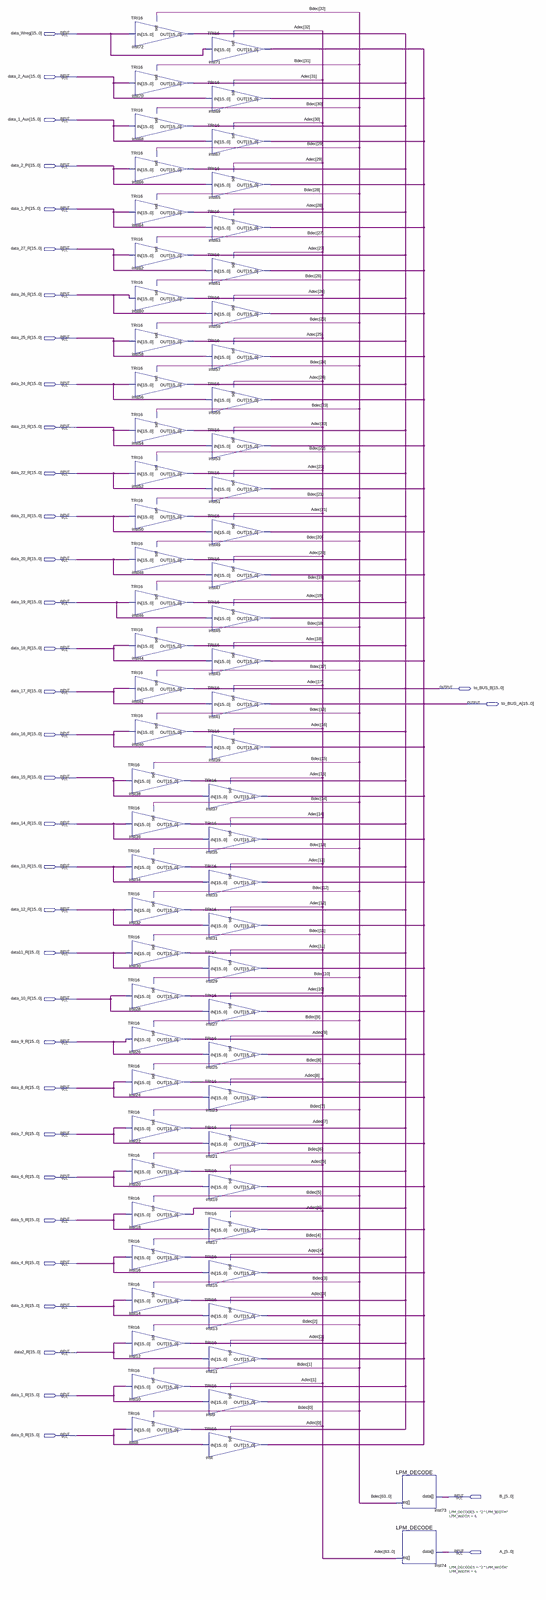
[diagram p0: schematic sheet, whole]
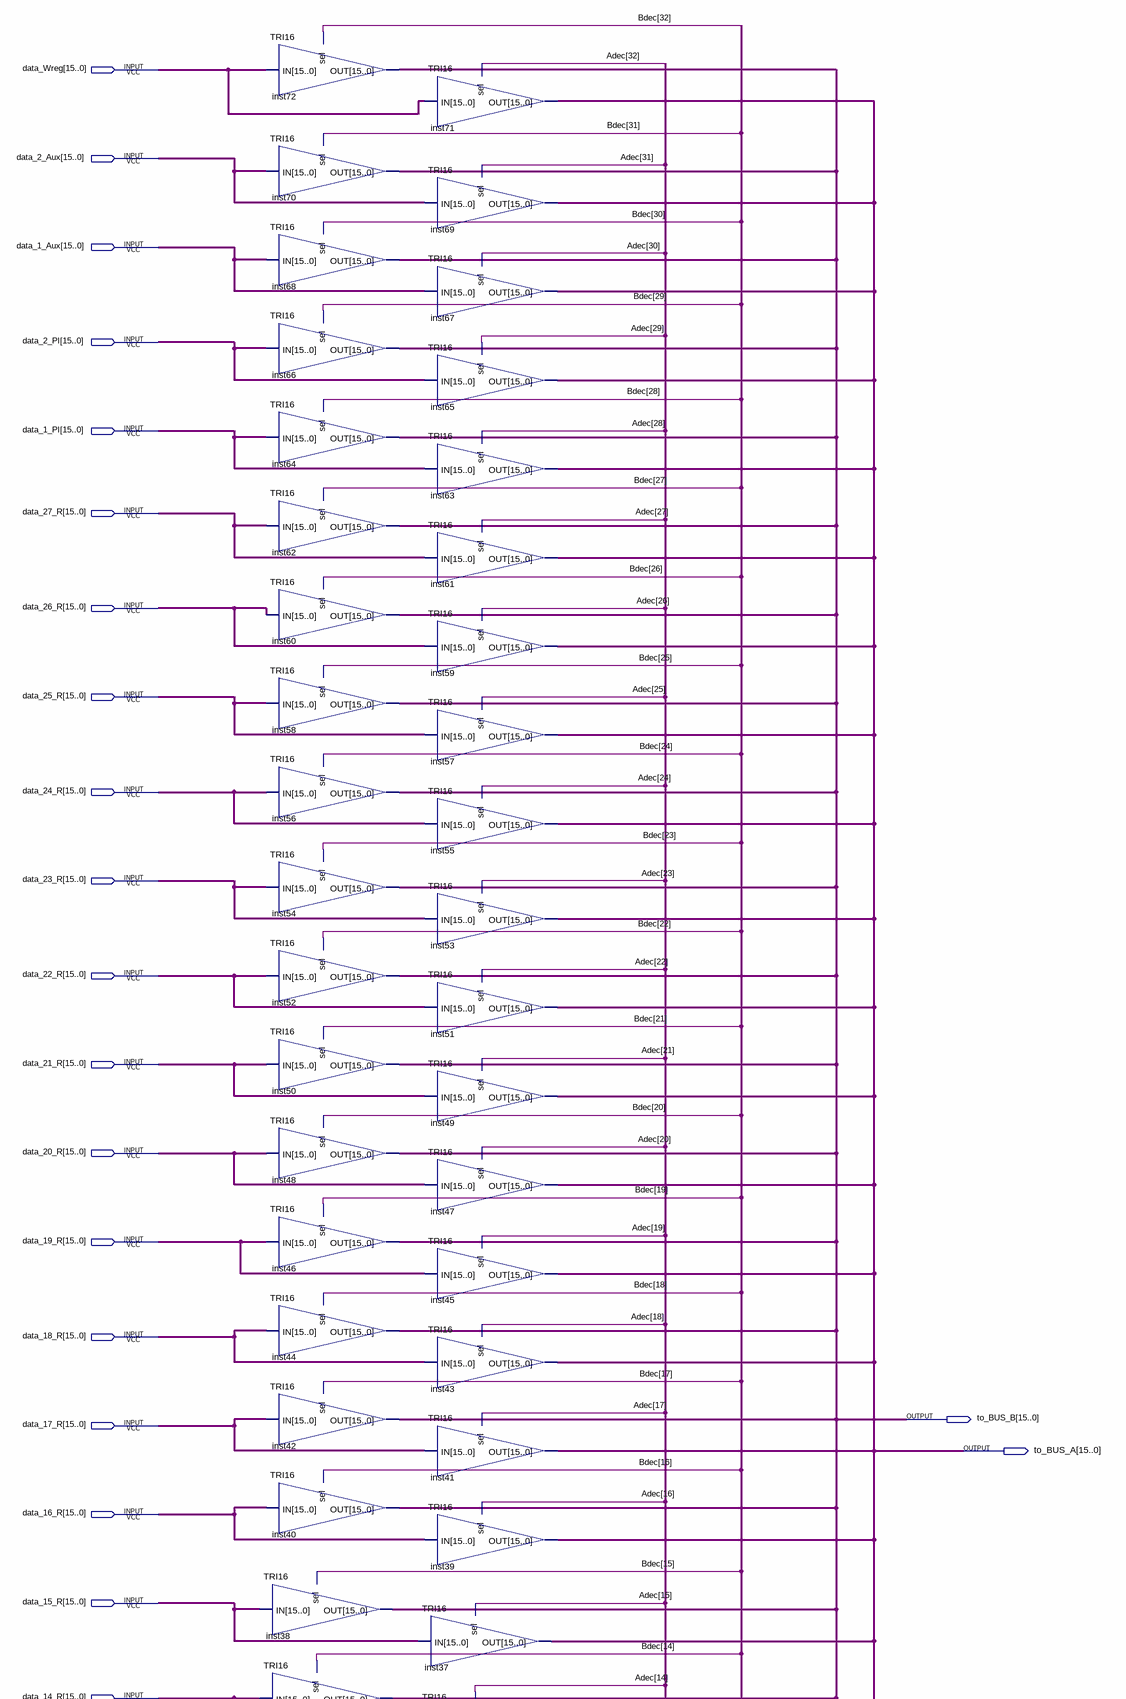
[diagram p1: schematic sheet, upper part]
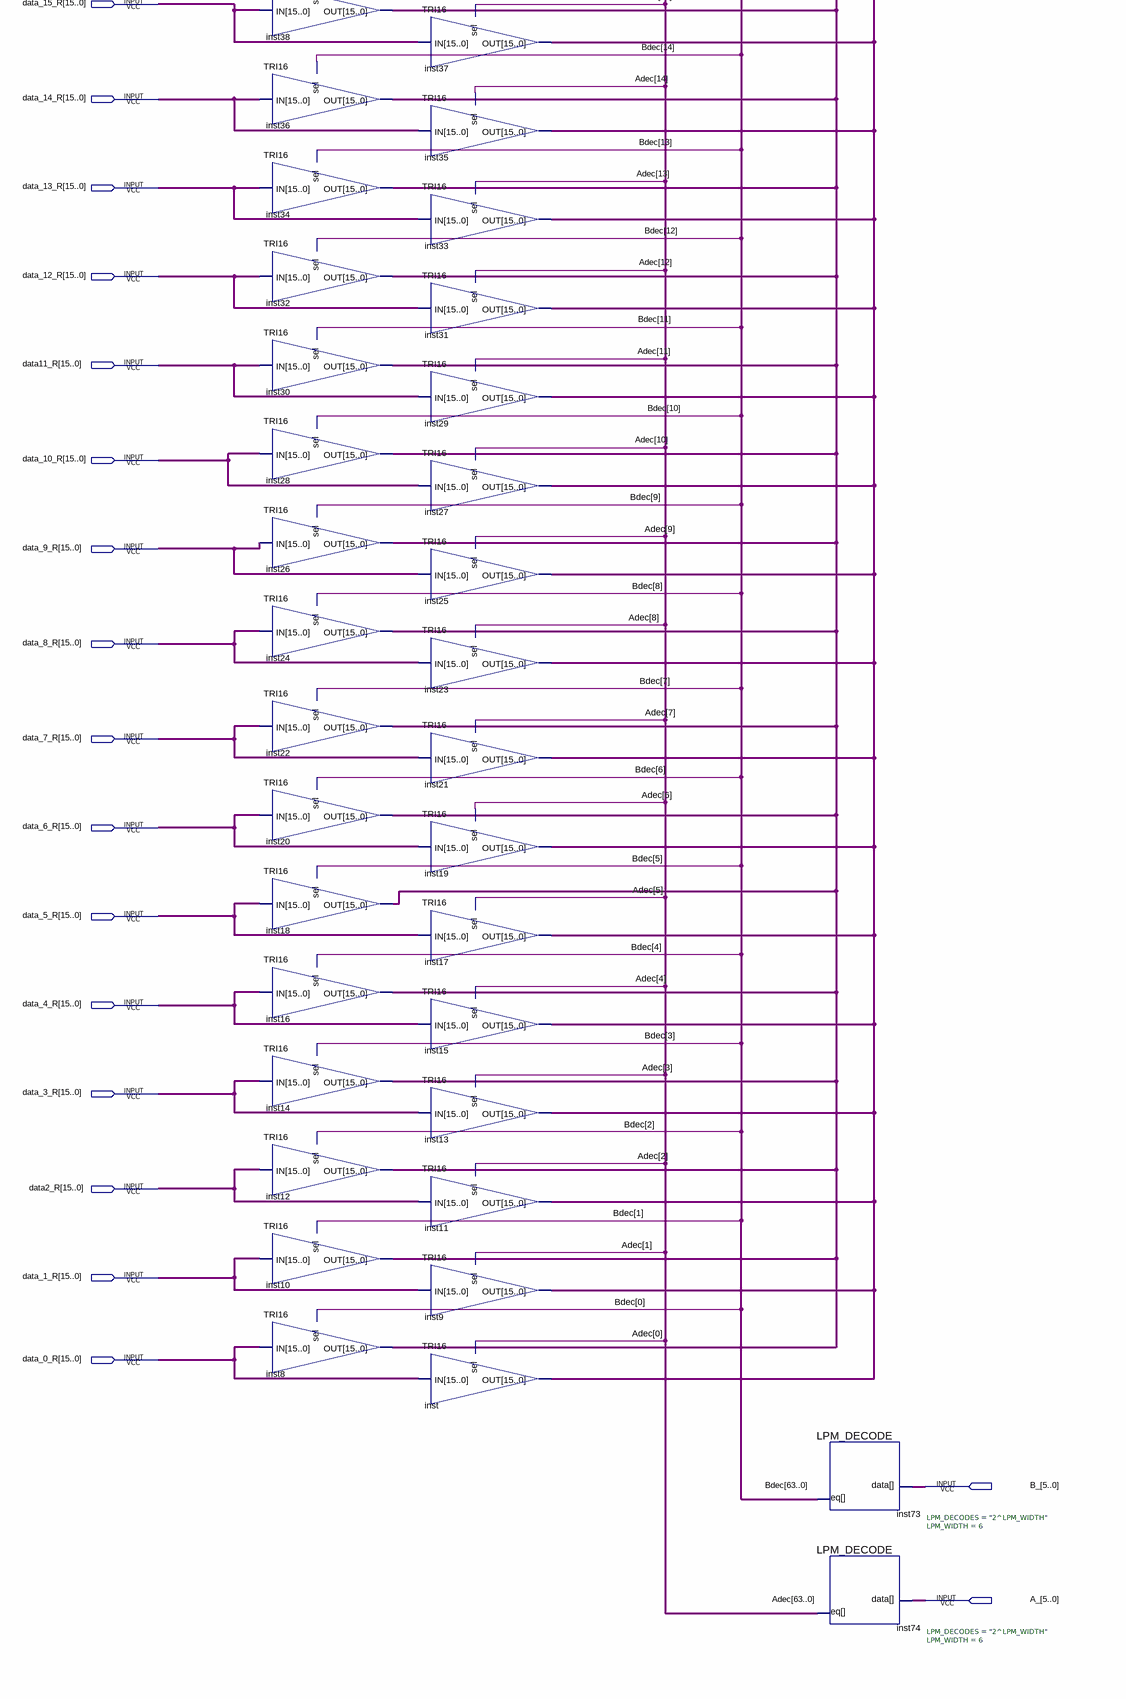
[diagram p2: schematic sheet, lower part]
// Quartus schematic block3.bdf as structural Verilog: 68 symbols, 37 pins
module block3 (
  input  [15:0] data_Wreg,
  input  [15:0] data_2_Aux,
  input  [15:0] data_1_Aux,
  input  [15:0] data_2_PI,
  input  [15:0] data_1_PI,
  input  [15:0] data_27_R,
  input  [15:0] data_26_R,
  input  [15:0] data_25_R,
  input  [15:0] data_24_R,
  input  [15:0] data_23_R,
  input  [15:0] data_22_R,
  input  [15:0] data_21_R,
  input  [15:0] data_20_R,
  input  [15:0] data_19_R,
  input  [15:0] data_18_R,
  input  [15:0] data_17_R,
  input  [15:0] data_16_R,
  input  [15:0] data_15_R,
  input  [15:0] data_14_R,
  input  [15:0] data_13_R,
  input  [15:0] data_12_R,
  input  [15:0] data11_R,
  input  [15:0] data_10_R,
  input  [15:0] data_9_R,
  input  [15:0] data_8_R,
  input  [15:0] data_7_R,
  input  [15:0] data_6_R,
  input  [15:0] data_5_R,
  input  [15:0] data_4_R,
  input  [15:0] data_3_R,
  input  [15:0] data2_R,
  input  [15:0] data_1_R,
  input  [15:0] data_0_R,
  input  [5:0] B_,
  input  [5:0] A_,
  output [15:0] to_BUS_B,
  output [15:0] to_BUS_A
);

  wire [63:0] Adec, Bdec;

  TRI16 inst72 (.sel(Bdec[32]), .IN(data_Wreg), .OUT(to_BUS_B));
  TRI16 inst70 (.sel(Bdec[31]), .IN(data_2_Aux), .OUT(to_BUS_B));
  TRI16 inst68 (.sel(Bdec[30]), .IN(data_1_Aux), .OUT(to_BUS_B));
  TRI16 inst66 (.sel(Bdec[29]), .IN(data_2_PI), .OUT(to_BUS_B));
  TRI16 inst64 (.sel(Bdec[28]), .IN(data_1_PI), .OUT(to_BUS_B));
  TRI16 inst62 (.sel(Bdec[27]), .IN(data_27_R), .OUT(to_BUS_B));
  TRI16 inst60 (.sel(Bdec[26]), .IN(data_26_R), .OUT(to_BUS_B));
  TRI16 inst58 (.sel(Bdec[25]), .IN(data_25_R), .OUT(to_BUS_B));
  TRI16 inst56 (.sel(Bdec[24]), .IN(data_24_R), .OUT(to_BUS_B));
  TRI16 inst54 (.sel(Bdec[23]), .IN(data_23_R), .OUT(to_BUS_B));
  TRI16 inst52 (.sel(Bdec[22]), .IN(data_22_R), .OUT(to_BUS_B));
  TRI16 inst50 (.sel(Bdec[21]), .IN(data_21_R), .OUT(to_BUS_B));
  TRI16 inst48 (.sel(Bdec[20]), .IN(data_20_R), .OUT(to_BUS_B));
  TRI16 inst46 (.sel(Bdec[19]), .IN(data_19_R), .OUT(to_BUS_B));
  TRI16 inst44 (.sel(Bdec[18]), .IN(data_18_R), .OUT(to_BUS_B));
  TRI16 inst42 (.sel(Bdec[17]), .IN(data_17_R), .OUT(to_BUS_B));
  TRI16 inst40 (.sel(Bdec[16]), .IN(data_16_R), .OUT(to_BUS_B));
  TRI16 inst38 (.sel(Bdec[15]), .IN(data_15_R), .OUT(to_BUS_B));
  TRI16 inst36 (.sel(Bdec[14]), .IN(data_14_R), .OUT(to_BUS_B));
  TRI16 inst34 (.sel(Bdec[13]), .IN(data_13_R), .OUT(to_BUS_B));
  TRI16 inst32 (.sel(Bdec[12]), .IN(data_12_R), .OUT(to_BUS_B));
  TRI16 inst30 (.sel(Bdec[11]), .IN(data11_R), .OUT(to_BUS_B));
  TRI16 inst28 (.sel(Bdec[10]), .IN(data_10_R), .OUT(to_BUS_B));
  TRI16 inst26 (.sel(Bdec[9]), .IN(data_9_R), .OUT(to_BUS_B));
  TRI16 inst24 (.sel(Bdec[8]), .IN(data_8_R), .OUT(to_BUS_B));
  TRI16 inst22 (.sel(Bdec[7]), .IN(data_7_R), .OUT(to_BUS_B));
  TRI16 inst20 (.sel(Bdec[6]), .IN(data_6_R), .OUT(to_BUS_B));
  TRI16 inst18 (.sel(Bdec[5]), .IN(data_5_R), .OUT(to_BUS_B));
  TRI16 inst16 (.sel(Bdec[4]), .IN(data_4_R), .OUT(to_BUS_B));
  TRI16 inst14 (.sel(Bdec[3]), .IN(data_3_R), .OUT(to_BUS_B));
  TRI16 inst12 (.sel(Bdec[2]), .IN(data2_R), .OUT(to_BUS_B));
  TRI16 inst10 (.sel(Bdec[1]), .IN(data_1_R), .OUT(to_BUS_B));
  TRI16 inst8 (.sel(Bdec[0]), .IN(data_0_R), .OUT(to_BUS_B));
  TRI16 inst71 (.sel(Adec[32]), .IN(data_Wreg), .OUT(to_BUS_A));
  TRI16 inst69 (.sel(Adec[31]), .IN(data_2_Aux), .OUT(to_BUS_A));
  TRI16 inst67 (.sel(Adec[30]), .IN(data_1_Aux), .OUT(to_BUS_A));
  TRI16 inst65 (.sel(Adec[29]), .IN(data_2_PI), .OUT(to_BUS_A));
  TRI16 inst63 (.sel(Adec[28]), .IN(data_1_PI), .OUT(to_BUS_A));
  TRI16 inst61 (.sel(Adec[27]), .IN(data_27_R), .OUT(to_BUS_A));
  TRI16 inst59 (.sel(Adec[26]), .IN(data_26_R), .OUT(to_BUS_A));
  TRI16 inst57 (.sel(Adec[25]), .IN(data_25_R), .OUT(to_BUS_A));
  TRI16 inst55 (.sel(Adec[24]), .IN(data_24_R), .OUT(to_BUS_A));
  TRI16 inst53 (.sel(Adec[23]), .IN(data_23_R), .OUT(to_BUS_A));
  TRI16 inst51 (.sel(Adec[22]), .IN(data_22_R), .OUT(to_BUS_A));
  TRI16 inst49 (.sel(Adec[21]), .IN(data_21_R), .OUT(to_BUS_A));
  TRI16 inst47 (.sel(Adec[20]), .IN(data_20_R), .OUT(to_BUS_A));
  TRI16 inst45 (.sel(Adec[19]), .IN(data_19_R), .OUT(to_BUS_A));
  TRI16 inst43 (.sel(Adec[18]), .IN(data_18_R), .OUT(to_BUS_A));
  TRI16 inst41 (.sel(Adec[17]), .IN(data_17_R), .OUT(to_BUS_A));
  TRI16 inst39 (.sel(Adec[16]), .IN(data_16_R), .OUT(to_BUS_A));
  TRI16 inst37 (.sel(Adec[15]), .IN(data_15_R), .OUT(to_BUS_A));
  TRI16 inst35 (.sel(Adec[14]), .IN(data_14_R), .OUT(to_BUS_A));
  TRI16 inst33 (.sel(Adec[13]), .IN(data_13_R), .OUT(to_BUS_A));
  TRI16 inst31 (.sel(Adec[12]), .IN(data_12_R), .OUT(to_BUS_A));
  TRI16 inst29 (.sel(Adec[11]), .IN(data11_R), .OUT(to_BUS_A));
  TRI16 inst27 (.sel(Adec[10]), .IN(data_10_R), .OUT(to_BUS_A));
  TRI16 inst25 (.sel(Adec[9]), .IN(data_9_R), .OUT(to_BUS_A));
  TRI16 inst23 (.sel(Adec[8]), .IN(data_8_R), .OUT(to_BUS_A));
  TRI16 inst21 (.sel(Adec[7]), .IN(data_7_R), .OUT(to_BUS_A));
  TRI16 inst19 (.sel(Adec[6]), .IN(data_6_R), .OUT(to_BUS_A));
  TRI16 inst17 (.sel(Adec[5]), .IN(data_5_R), .OUT(to_BUS_A));
  TRI16 inst15 (.sel(Adec[4]), .IN(data_4_R), .OUT(to_BUS_A));
  TRI16 inst13 (.sel(Adec[3]), .IN(data_3_R), .OUT(to_BUS_A));
  TRI16 inst11 (.sel(Adec[2]), .IN(data2_R), .OUT(to_BUS_A));
  TRI16 inst9 (.sel(Adec[1]), .IN(data_1_R), .OUT(to_BUS_A));
  TRI16 inst (.sel(Adec[0]), .IN(data_0_R), .OUT(to_BUS_A));
  LPM_DECODE #(.LPM_DECODES("2^LPM_WIDTH"), .LPM_WIDTH(6)) inst73 (.data(B_), .eq(Bdec));
  LPM_DECODE #(.LPM_DECODES("2^LPM_WIDTH"), .LPM_WIDTH(6)) inst74 (.data(A_), .eq(Adec));
endmodule
